# Altium schematic sheet CurrentSensor.SchDoc
size A4
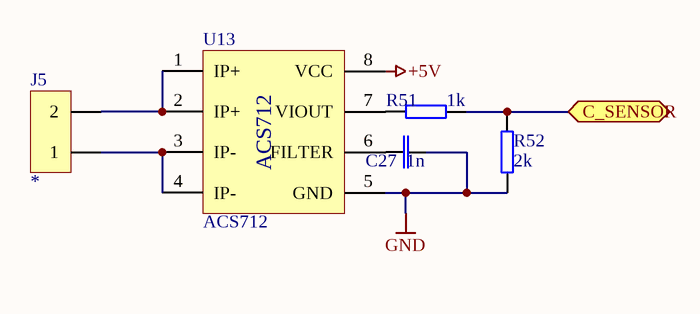
[diagram p0: CurrentSensor.SchDoc]

## Parts
C27  1n  [CAP 0805]
J5  *  [PTR_AKZ350]
R51  1k  [RES 0805]
R52  2k  [RES 0805]
U13  ACS712  [SO8]

## Ports
C_SENSOR (bidir)

## Nets
+5V: U13.8(VCC)
GND: C27.1 R52.1 U13.5(GND)
C_SENSOR: R51.1 R52.2 ; port C_SENSOR
NetC27_2: C27.2 U13.6(FILTER)
NetJ5_1: J5.1 U13.3(IP-) U13.4(IP-)
NetJ5_2: J5.2 U13.1(IP+) U13.2(IP+)
NetR51_2: R51.2 U13.7(VIOUT)

## Library data of the parts
C27 = CAP: NON POLARIZED CAPACITOR; VALUE: 1n; Reference: 82-01-25; Supplier: LOMEX
J5 = HEADER2: 2 PIN HEADER; REFERENCE ID: *; DISTRIBUTOR: *; VALUE: *
R51 R52 = RES: RESISTOR; Reference: 81-10-83; Supplier: LOMEX
  R51: VALUE: 1k
  R52: VALUE: 2k
U13 = ACS712: Current sensor IC; Name: ACS712; Datasheet: https://www.sparkfun.com/datasheets/BreakoutBoards/0712.pdf